# Altium schematic sheet DAC.SchDoc: Digital/Analog Converter
size A4; Address1: Smoka Wawelskiego 1; Address2: 30-535 Kraków, Poland; DocumentNumber: 5; Revision: v01; SheetNumber: 5; SheetTotal: 9; Author: Miroslaw Folejewski; CompanyName: Mirko Electronics; DrawnBy: Miroslaw Folejewski; Engineer: Miroslaw Folejewski; PageSetup: Record=PageOptions|CenterHorizontal=True|CenterVertical=True|PrintScale=1.00|XCorrection=1.00|YCorrection=1.00|PrintKind=0|BorderSize=5000000|LeftOffset=0|BottomOffset=0|Orientation=2|PaperLength=1000|PaperWidth=1000|Scale=100|PaperSource=7|PrintQuality=-4|MediaType=1|DitherType=10|PaperKind=A4|PrintScaleMode=1; PageSize: A4; Designators: -; ProjectName: 7-Segment LED Matrix Display
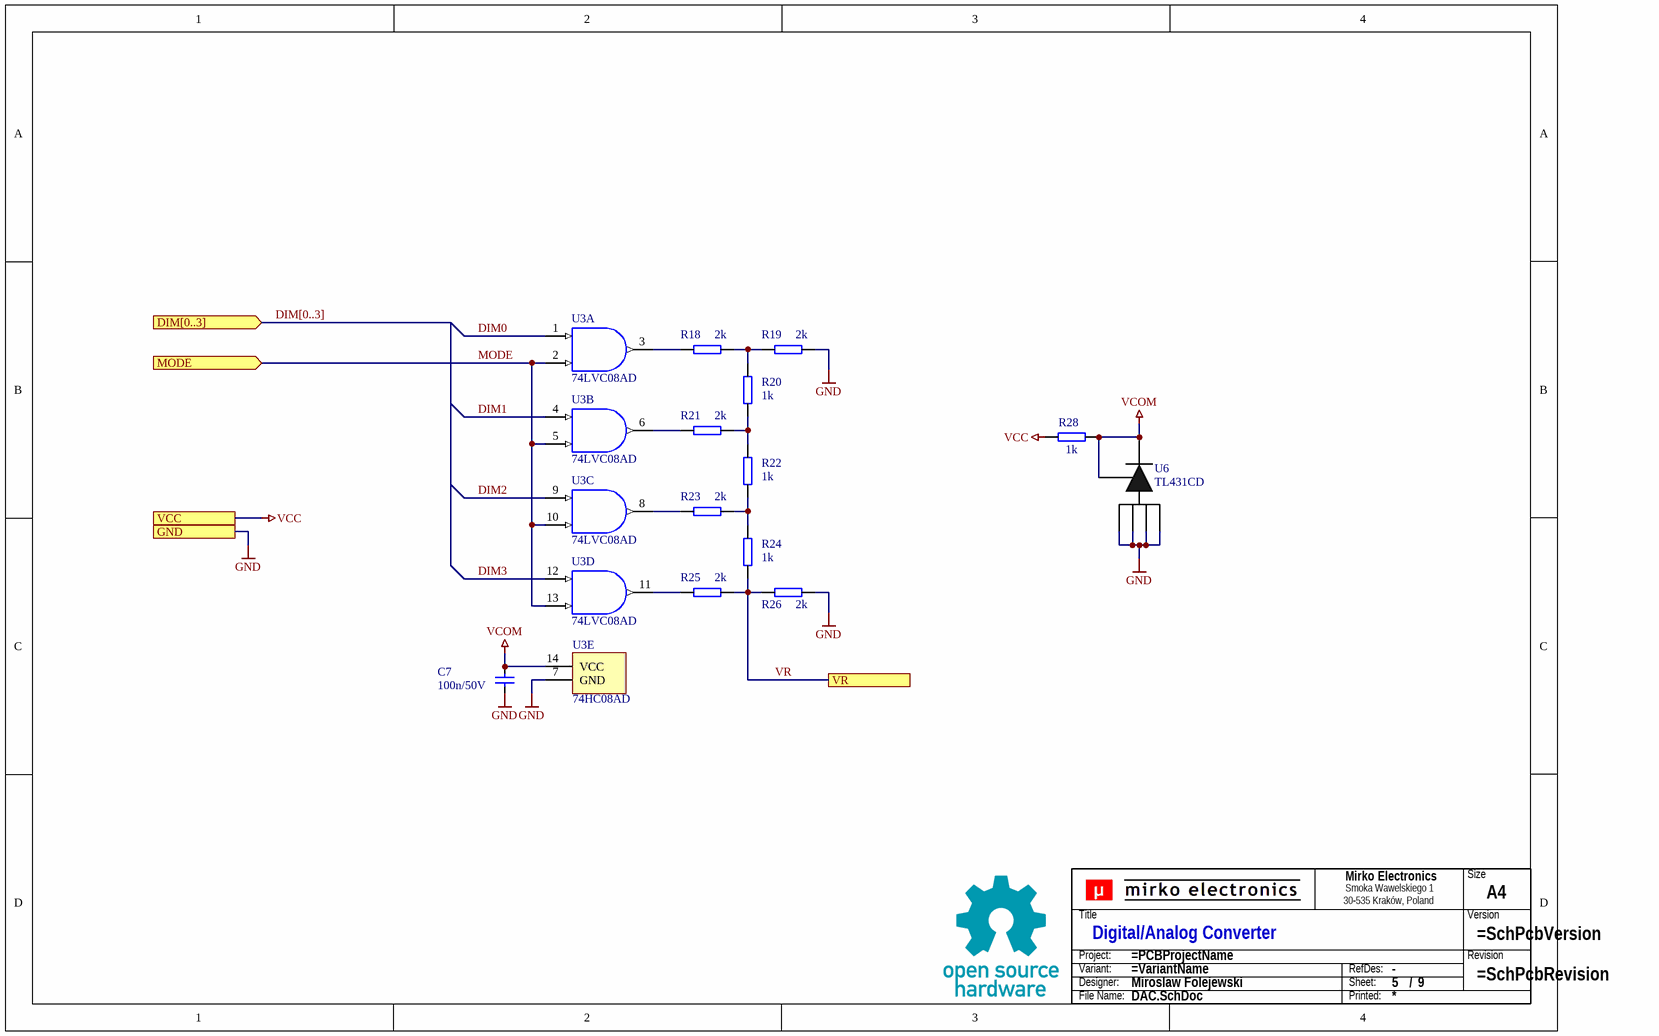
[diagram p0: DAC.SchDoc]

## Parts
?  (no value)  (graphical)
C7  100n/50V  [0805]
R18  2k  [0805]
R19  2k  [0805]
R20  1k  [0805]
R21  2k  [0805]
R22  1k  [0805]
R23  2k  [0805]
R24  1k  [0805]
R25  2k  [0805]
R26  2k  [0805]
R28  1k  [0805]
TB?  Title block  (value not drawn)  (graphical)
U3  74LVC08AD  [SO14]  (parts A,B,C,D,E of 5)
U6  TL431CD  [SO8]

## Ports
DIM[0..3] (in), GND, MODE (in), VCC, VR

## Nets
GND: C7.2 R19.2 R26.2 U3.7(GND) U6.2(A) U6.3(A) U6.6(A) U6.7(A) ; port GND
VCC: R28.1 ; port VCC
VCOM: C7.1 R28.2 U3.14(VCC) U6.1(C) U6.8(REF)
DIM0: U3.1(A)
DIM1: U3.4(A)
DIM2: U3.9(A)
DIM3: U3.12(A)
MODE: U3.2(B) U3.5(B) U3.10(B) U3.13(B) ; port MODE
VR: R24.1 R25.2 R26.1 ; port VR
NetR18_1: R18.1 U3.3(Y)
NetR18_2: R18.2 R19.1 R20.2
NetR20_1: R20.1 R21.2 R22.2
NetR21_1: R21.1 U3.6(Y)
NetR22_1: R22.1 R23.2 R24.2
NetR23_1: R23.1 U3.8(Y)
NetR25_1: R25.1 U3.11(Y)

## Buses and harness runs
bus DIM[0..3] = port DIM[0..3]

## Notes on the sheet
- Title
- Size
- Revision
- Checked By:
- Project:
- Variant:
- Engineer:
- Date:
- Sheet:
- /
- Designators
- Approved By:
- File:
- (in symbol SCH_TITLE_BLOCK_V1) Size; Title; Version; Project:; Revision; Variant:; RefDes:; Designer:; Sheet:; /; File Name:; Printed:

## Library data of the parts
? = Title Block NeoStrain
C7 = CAP
R18-R26 R28 = R0805
TB? = SCH_TITLE_BLOCK_V1: Component Type: Title block; Manufacturer: -; Mounting Type: Non component; MPN: -; Operating Temperature: -; Package: -; Specification: Title block; Value: Title block; Replacement: -; System: ?
U3 = 74AC08: Quadruple 2-Input Positive-AND Gate
U6 = TL431CD: REF